# Altium schematic sheet h_sensor_safety.SchDoc
size A; SheetNumber: 1; SheetTotal: 1
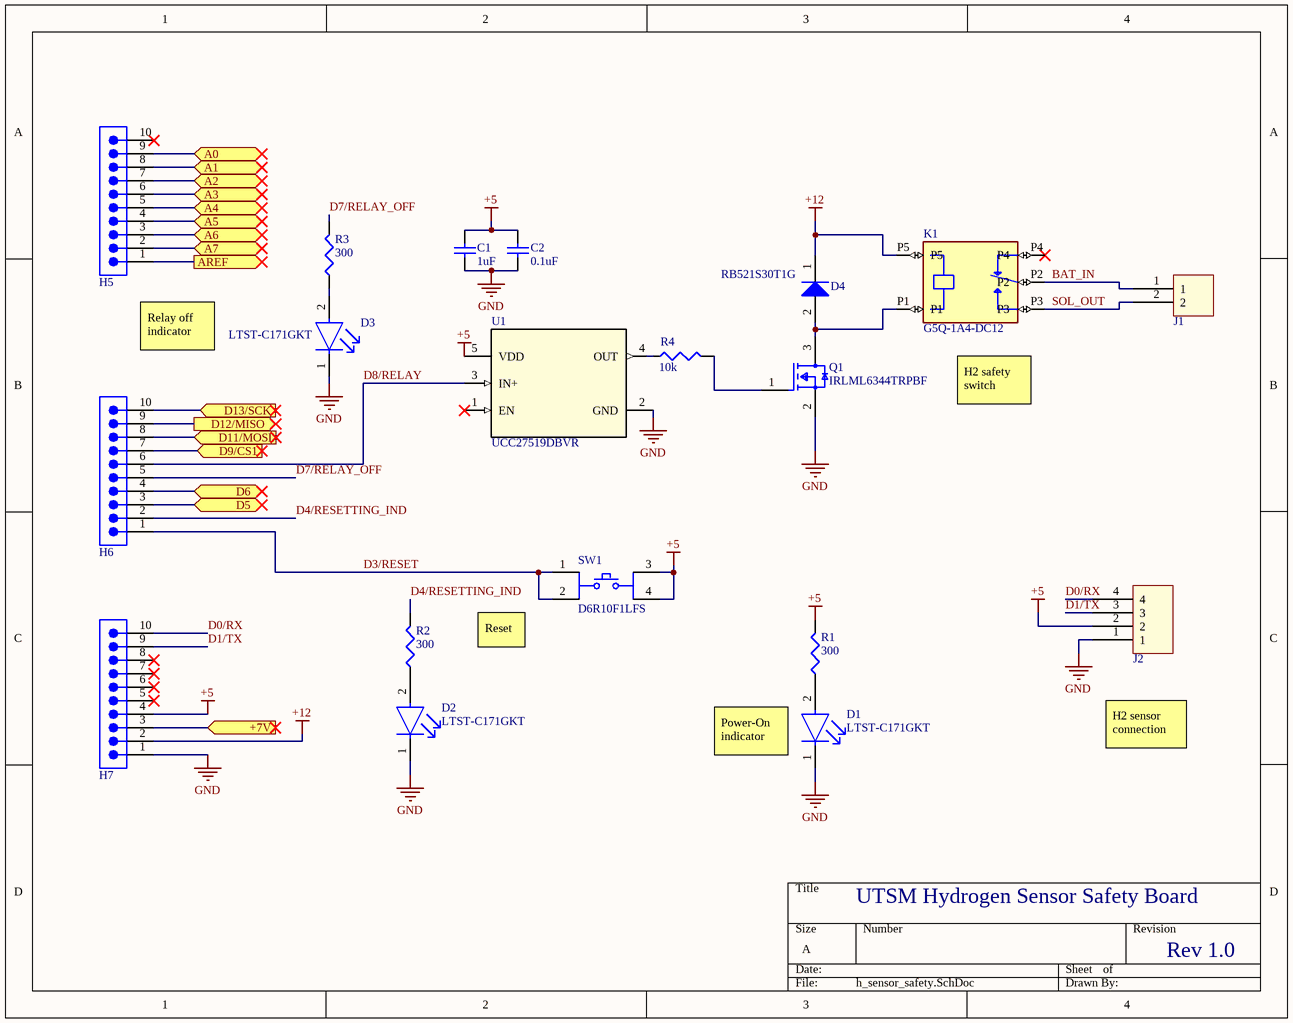
[diagram p0: h_sensor_safety.SchDoc]

## Parts
C1  value 1uF  [0603c]
C2  value 0.1uF  [0603c]
D1  LTST-C171GKT  [FP-LTST-C171GKT-MFG]
D2  LTST-C171GKT  [FP-LTST-C171GKT-MFG]
D3  LTST-C171GKT  [FP-LTST-C171GKT-MFG]
D4  RB521S30T1G  [ONSC-SOD-523-2-502-01_V]
H5  (no value)  [61301011121]
H6  (no value)  [61301011121]
H7  (no value)  [61301011121]
J1  header 2 pos minifit right angle  [0039300020 minifit 2 pos]  (value not drawn)
J2  header 4 pos microfit right angle single row  [0436500401 MICROFIT 4 POS RIGHT ANGLE SINGLE ROW]  (value not drawn)
K1  G5Q-1A4-DC12  [G5Q-1A4-DC12]
Q1  IRLML6344TRPBF  [FP-Micro3-MFG]
R1  value 300  [0603r]  (hidden comment: Res3)
R2  value 300  [0603r]  (hidden comment: Res3)
R3  value 300  [0603r]  (hidden comment: Res3)
R4  value 10k  [0603r]  (hidden comment: Res3)
SW1  D6R10F1LFS  [FP-D6R10F1LFS-MFG]
U1  UCC27519DBVR  [SOT95P280X145-5N]

## Ports
+7V (in), A0 (bidir), A1 (bidir), A2 (bidir), A3 (bidir), A4 (bidir), A5 (bidir), A6 (bidir), A7 (bidir), AREF (out), D5 (bidir), D6 (bidir), D9/CS1 (in), D11/MOSI (in), D12/MISO (out), D13/SCK (in)

## Nets
+5: C1.2 C2.2 H7.4 J2.2 R1.2 SW1.3 SW1.4 U1.5(VDD)
+12: D4.1(K) H7.2 K1.P5
GND: C1.1 C2.1 D1.1(C) D2.1(C) D3.1(C) H7.1 J2.1 Q1.2(S) U1.2(GND)
+7V: H7.3 ; port +7V
A0: H5.9 ; port A0
A1: H5.8 ; port A1
A2: H5.7 ; port A2
A3: H5.6 ; port A3
A4: H5.5 ; port A4
A5: H5.4 ; port A5
A6: H5.3 ; port A6
A7: H5.2 ; port A7
AREF: H5.1 ; port AREF
BAT_IN: J1.1 K1.P2
D0/RX: H7.10 J2.4
D1/TX: H7.9 J2.3
D3/RESET: H6.1 SW1.1 SW1.2
D4/RESETTING_IND: H6.2 R2.2
D5: H6.3 ; port D5
D6: H6.4 ; port D6
D7/RELAY_OFF: H6.5 R3.2
D8/RELAY: H6.6 U1.3(IN+)
D9/CS1: H6.7 ; port D9/CS1
D11/MOSI: H6.8 ; port D11/MOSI
D12/MISO: H6.9 ; port D12/MISO
D13/SCK: H6.10 ; port D13/SCK
SOL_OUT: J1.2 K1.P3
NetD1_2: D1.2(A) R1.1
NetD2_2: D2.2(A) R2.1
NetD3_2: D3.2(A) R3.1
NetD4_2: D4.2(A) K1.P1 Q1.3(D)
NetQ1_1: Q1.1(G) R4.2
NetR4_1: R4.1 U1.4(OUT)

Not connected (* = marked no-connect by the designer): H5 10*; H7 5* 6* 7* 8*; K1 P4*; U1 1(EN)*

## Notes on the sheet
- Relay off indicator
- (near K1) H2 safety switch
- Reset
- Power-On indicator
- H2 sensor connection
- UTSM Hydrogen Sensor Safety Board
- Rev 1.0

## Library data of the parts
C1 C2 = Cap: 0603 Capacitor; Published: 8-Jun-2000; LatestRevisionDate: 17-Jul-2002; LatestRevisionNote: Re-released for DXP Platform.; PackageReference: RAD-0.3; Publisher: Altium Limited; PackageDescription: Radial Cap, Thru-Hole; 2 Leads; 0.3 in Pin Spacing
D1-D3 = CMP-22017-000007-1: LED GREEN CLEAR CHIP SMD; Luminous Intensity: 12mcd; Lens Color: Colorless; Dominant Wavelength: 569nm; Number of LEDs: 1; Power Dissipation: 100mW; Viewing Angle: 130°; Reverse Voltage: 5V; Test Current: 10mA; Forward Voltage: 2.1V; Wavelength: 585nm; Lens Style: Diffused; Forward Current: 30mA; Height: 0.8mm; Mount: Surface Mount; Package Quantity: 1; Length: 2mm; Case Code (Metric): 2012; Number of Pins: 2; Number of Elements: 1; Packaging: Tape and Reel; Color: Green; Min Operating Temperature: -55°C; Case/Package: 0805; Power Rating: 100mW; Max Operating Temperature: 85°C; Radiation Hardening: No; Depth: 1.25mm; Lens Transparency: Clear; Width: 1.25mm; Lead Free: Lead Free; Case Code (Imperial): 0805; Illumination Color: Green
D4 = CMP-1051-00018-1: Schottky Barrier Diode, 2-Pin SOD-523, Pb-Free, Tape and Reel; Manufacturer: On Semiconductor; Configuration: Single; IFSM Max (A): 1; Mounting Technology: Surface Mount; ComponentLink1Description: Manufacturer URL; PackageReference: SOD-523-2-502-01; RoHS: TRUE; ComponentLink3Description: Package Specification; ComponentLink2Description: Datasheet; PackageVersion: Rev. E, 09/2010; PartNumber: RB521S30T1G; ComponentLink3URL: http://www.onsemi.com/pub_link/Collateral/502-01.PDF; ComponentLink1URL: http://www.onsemi.com/; PackageDescription: 2-Pin SOD, Body 1.2 x 0.8 mm; DatasheetVersion: Rev. 8; ComponentLink2URL: http://www.onsemi.cn/pub_link/Collateral/RB521S30T1-D.PDF; Packing: Tape and Reel
H5-H7 = 61301011121: WR-PHD Pin Header, THT, Vertical, pitch 2.54mm, 1 Row, 10P; Manufacturer: Wurth Elektronik; Contact Resistance: 20mOhm; Rated Current: 3A; Working Voltage: 250V; Withstanding Voltage: 500V; Manufacturer Part Number: 61301011121; Category: Board-to-Board Connectors; Match Code: WR-PHD; ComponentLink1Description: Website Link; ComponentLink1URL: https://www.we-online.com/redexpert/article/61301011121?ad; ComponentLink2Description: Datasheet Link; ComponentLink2URL: https://www.we-online.com/redexpert/spec/61301011121?ad; Mount: Through Hole; Operating Temperature Max: 105°C; Operating Temperature Min: -40°C; Packaging: Bag; Gender: Pin Header; Number of Pins: 10; Number of Rows: 1; Orientation: Vertical; Pitch: 2.54mm
K1 = G5Q-1A4-DC12: General Purpose Relay Ã¢â‚¬Â¢ Coil Voltage: 12 VDC Ã¢â‚¬Â¢ Contact Configuration: 1A SPST-NO Ã¢â‚¬Â¢ Current : 10 Amps Ã¢â‚¬Â¢ Mounting : PC Board Ã¢â‚¬Â¢ Operating Function: Single Side Stable; MF: Omron Electronics; SnapEDA_Link: https://www.snapeda.com/parts/G5Q-1A4-DC12/Omron+Electronics+Inc-EMC+Div/view-part/?ref=snap; Package: None; Value: *; MP: G5Q-1A4-DC12; Check_prices: https://www.snapeda.com/parts/G5Q-1A4-DC12/Omron+Electronics+Inc-EMC+Div/view-part/?ref=eda
Q1 = CMP-32901-000110-1: MOSFET N-CH 30V 2.7A SOT-23-3; Manufacturer Part Number: IRLML2030TRPBF; Manufacturer: Infineon; Depletion Mode: False; Threshold Vgs Min: 1.3V; Number Of N Channels: 1; Turn Off Delay Time: 4.5ns; Gate To Source Voltage: 20V; Turn On Delay Time: 4.1ns; Max Forward Diode Voltage: 1V; Standoff Height: 0.01mm; Drain To Source Resistance: 123mΩ; Input Capacitace At Vds: 110pF @ 15V; Threshold Vgs Max: 2.3V; Gate Charge At Vgs: 1nC @ 4.5V; Power Dissipation: 1.3W; Reverse Recovery Charge: 0.3nC; Rthja Max: 100°C/W; Max Junction Temp: +150°C; Reverse Recovery Time: 9ns; Pulse Drain Current: 11A; Temperature: -55°C to +150°C; Octopart: https://octopart.com/irlml2030trpbf-infineon-65874966; Height: 1.12mm; Device Class L3: MOSFETs; Lead Free: Yes; Temperature Range Low: -55°C; Footprint Url: http://www.irf.com/package/outline/po_micro3.pdf; RoHS: TRUE; Automotive: No; Device Class L1: Discrete Semiconductors; ComponentLink2URL: https://www.infineon.com/dgdl/irlml2030pbf.pdf?fileId=5546d462533600a401535664aef525ec; Number Of Channels: 1; ComponentLink2Description: Datasheet; Category: Trans; Continuous Drain Current: 2.7A; Device Class L2: Transistors; Drain To Source Voltage: 30V; Drain To Source Breakdown Voltage: 30V; Temperature Range High: +150°C; Digikey Description: MOSFET N-CH 30V 2.7A SOT-23-3; Package: Micro3; Ipc Land Pattern Name: SOT95P237X100-3
R1-R4 = Res3: SMD Resistor; Published: 8-Jun-2000; LatestRevisionDate: 29-May-2009; LatestRevisionNote: IPC-7351 Footprint Added.; PackageReference: J1-0603; Publisher: Altium Limited; PackageDescription: Chip Resistor
SW1 = CMP-10035-000004-1: SWITCH PUSH SPST-NO 0.1A 32V; Current Rating: 100mA; Electrical Life: 250000Cycles; Power Rating: 3W; Number of Terminals/Pins: 4; Actuator Length: 7mm; Actuator Type: Round, Button; Actuator Color: Grey; Operating Force: 1.3N; Row Spacing: 5mm; Throw Configuration: SPST; Switch Function: Off-Mom; Lead Free: Lead Free; Min Operating Temperature: -20°C; Series: D6; Voltage Rating (DC): 32V; Package Quantity: 2500; Max Operating Temperature: 85°C; Contact Plating: Silver; Packaging: Bulk; Color: Grey; RoHS Compliant: No; Max Voltage Rating (DC): 32V; Terminal Pitch: 5mm; Number of Pins: 4; Orientation: Straight; Mount: Through Hole; Termination: PC Pin; Diameter: 12mm; Max Current Rating: 100mA
U1 = UCC27519DBVR: Low side gate driver; Mfr_Name: Texas Instruments; Alternate_PartNumber: UCC27519DBVT; CompType: IC; Type: DEV; RefDes: RefDes; Copyright: Copyright (C) 2023 Ultra Librarian. All rights reserved.; Manufacturer_Part_Number: UCC27519DBVR; PartNumber: UCC27519DBVR; PackageReference: DBV0005A; MountType: SMT; RoHS: Y; Manufacturer: Texas Instruments
J1 = header 2 pos minifit right angle: Supplier 1: Digi-Key; Supplier 2: Digi-Key; Supplier Part Number 1: WM21351-ND; Supplier Part Number 2: WM16570-ND
J2 = header 4 pos microfit right angle single row: Supplier 1: Digi-Key; Supplier Part Number 1: WM1865-ND